# EAGLE design Panel2 (EAGLE 9.2.0)
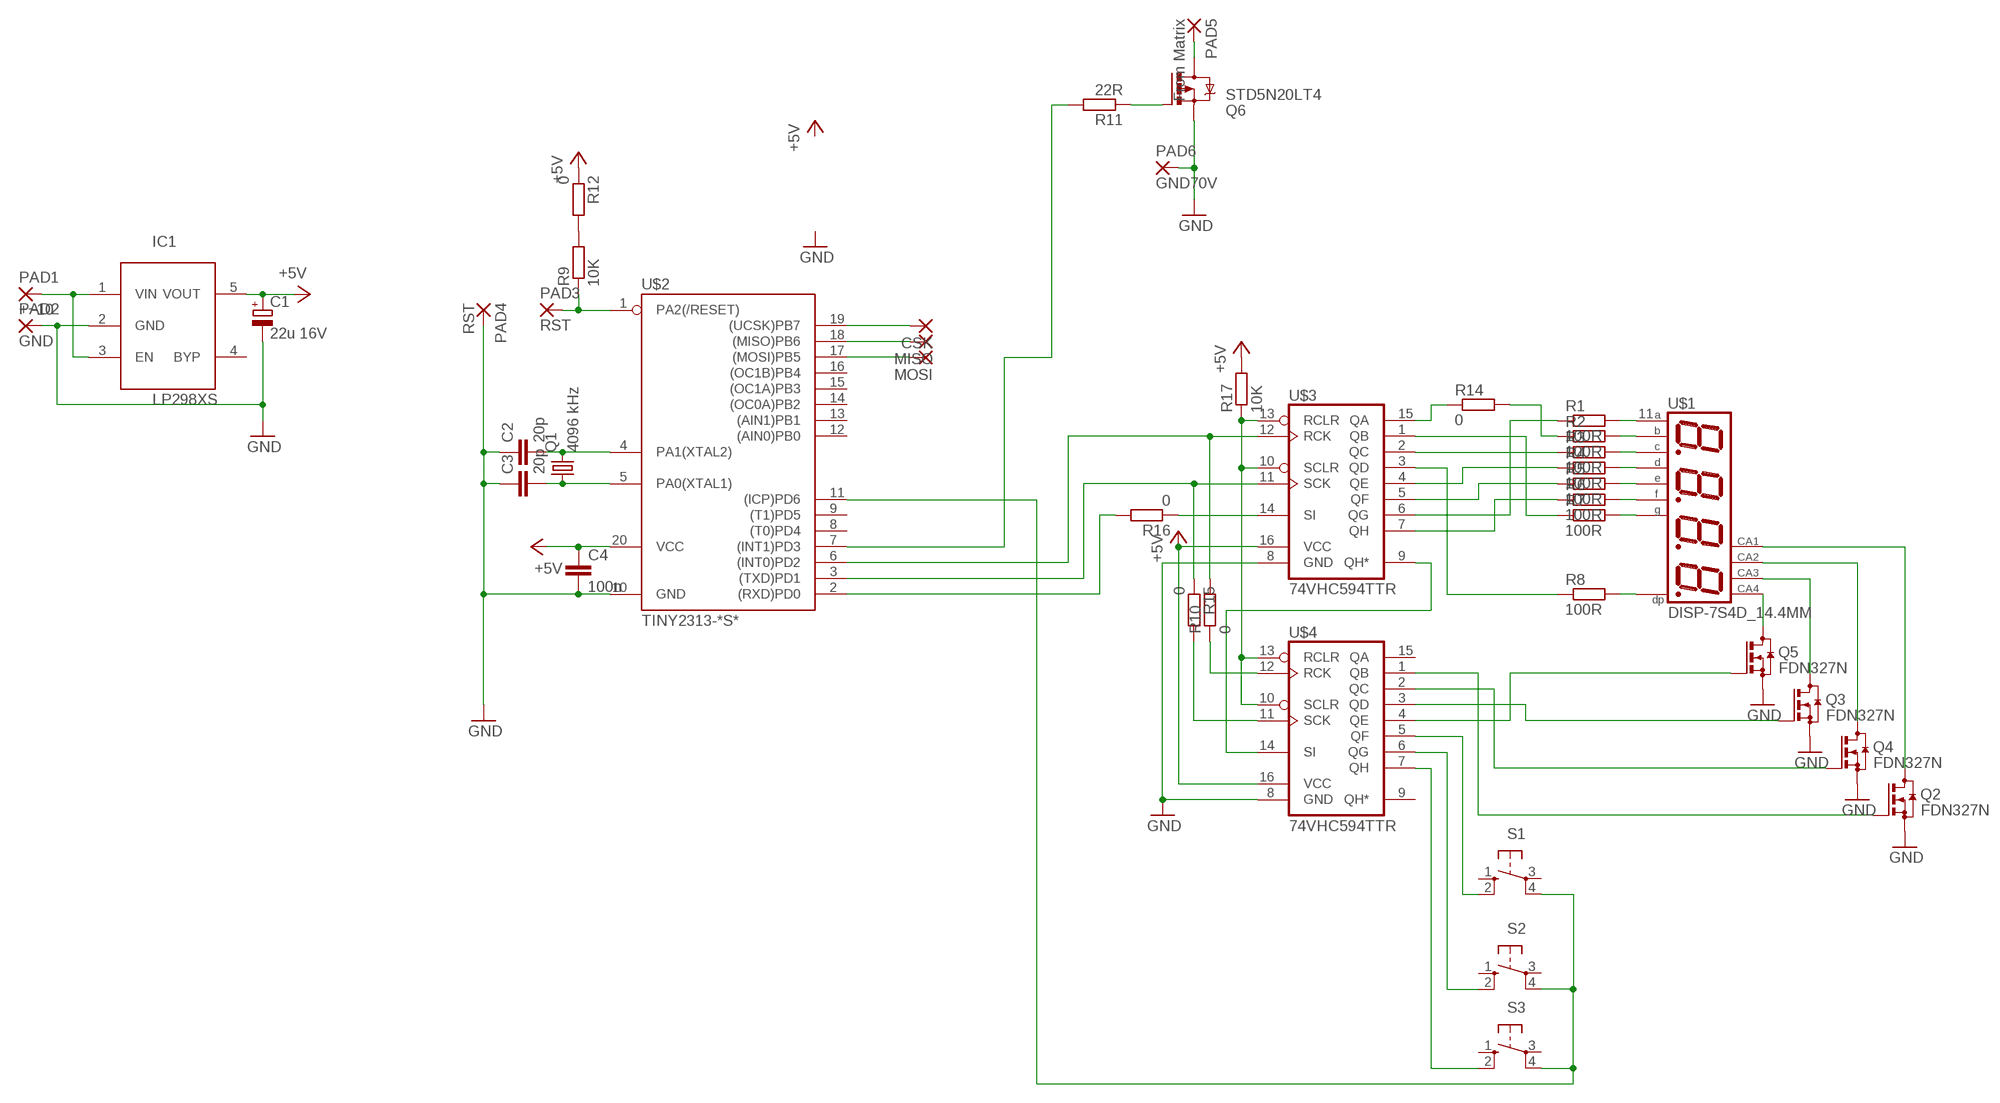
[diagram p0: schematic, sheet 1]

## Parts
C1  22u 16V  CPOL-EUSMCB  [SMC_B]
C2  20p  C-EUC1206  [C1206]
C3  20p  C-EUC1206  [C1206]
C4  100n  C-EUC1206  [C1206]
CSK  SMD2  [SMD1,27-2,54]
IC1  LP298XS  [SOT23-5L]
MISO  SMD2  [SMD1,27-2,54]
MOSI  SMD2  [SMD1,27-2,54]
PAD1  +~10  WIREPADSMD5-2,5  [5-2,5]
PAD2  GND  WIREPADSMD5-2,5  [5-2,5]
PAD3  RST  WIREPADSMD1,27-254  [SMD1,27-2,54]
PAD4  RST  WIREPADSMD1,27-254  [SMD1,27-2,54]
PAD5  From Matrix  WIREPADSMD2,54-5,08  [SMD2,54-5,08]
PAD6  GND70V  WIREPADSMD2,54-5,08  [SMD2,54-5,08]
Q1  4096 kHz  CRYSTALHC49U-V  [HC49U-V]
Q2  FDN327N  BSS123  [SOT23]
Q3  FDN327N  BSS123  [SOT23]
Q4  FDN327N  BSS123  [SOT23]
Q5  FDN327N  BSS123  [SOT23]
Q6  STD5N20LT4  IRFR5305  [D-PAK_TO252AA]
R1  100R  R-EU_R1206  [R1206]
R2  100R  R-EU_R1206  [R1206]
R3  100R  R-EU_R1206  [R1206]
R4  100R  R-EU_R1206  [R1206]
R5  100R  R-EU_R1206  [R1206]
R6  100R  R-EU_R1206  [R1206]
R7  100R  R-EU_R1206  [R1206]
R8  100R  R-EU_R1206  [R1206]
R9  10K  R-EU_R1206  [R1206]
R10  0  R-EU_R1206  [R1206]
R11  22R  R-EU_R1206  [R1206]
R12  0  R-EU_R1206  [R1206]
R14  0  R-EU_R1206  [R1206]
R15  0  R-EU_R1206  [R1206]
R16  0  R-EU_R1206  [R1206]
R17  10K  R-EU_R1206  [R1206]
S1  40-XX  [B3F-40XX]
S2  40-XX  [B3F-40XX]
S3  40-XX  [B3F-40XX]
U$1  DISP-7S4D_14.4MM  [DISP-7S4D]
U$2  TINY2313-*S*  [SO20L$]
U$3  74VHC594TTR  [TSSOP16]
U$4  74VHC594TTR  [TSSOP16]

## Nets
+5V: C1.+ C4.1 IC1.5(VOUT) R12.1 R17.2 U$2.20(VCC) U$3.16(VCC) U$4.16(VCC)
GND: C1.- C2.1 C3.1 C4.2 IC1.2(GND) PAD2.1(P) PAD4.1(P) PAD6.1(P) Q2.2(S) Q3.2(S) Q4.2(S) Q5.2(S) Q6.3(S) U$2.10(GND) U$3.8(GND) U$4.8(GND)
N$1: R1.2 U$1.11(A)
N$2: R2.2 U$1.7(B)
N$3: Q5.3(D) U$1.6(С4)
N$4: R3.2 U$1.4(C)
N$5: Q4.3(D) U$1.9(С2)
N$6: R4.2 U$1.2(D)
N$7: R5.2 U$1.1(E)
N$8: R6.2 U$1.10(F)
N$9: R7.2 U$1.5(G)
N$10: R8.2 U$1.3(DP)
N$11: IC1.1(VIN) IC1.3(EN) PAD1.1(P)
N$12: C2.2 Q1.2 U$2.4(PA1(XTAL2))
N$13: C3.2 Q1.1 U$2.5(PA0(XTAL1))
N$14: PAD3.1(P) R9.1 U$2.1(PA2(/RESET))
N$15: Q2.3(D) U$1.12(С1)
N$16: U$3.9(QH*) U$4.14(SI)
N$17: R15.1 U$2.3((TXD)PD1) U$3.11(SCK)
N$18: R10.2 U$2.6((INT0)PD2) U$3.12(RCK)
N$19: R17.1 U$3.10(SCLR) U$3.13(RCLR) U$4.10(SCLR) U$4.13(RCLR)
N$20: R14.1 U$3.15(QA)
N$21: Q2.1(G) U$4.1(QB)
N$22: R10.1 U$4.12(RCK)
N$23: R15.2 U$4.11(SCK)
N$24: R16.1 U$3.14(SI)
N$25: R7.1 U$3.1(QB)
N$26: R3.1 U$3.2(QC)
N$27: R8.1 U$3.3(QD)
N$28: R4.1 U$3.4(QE)
N$29: R5.1 U$3.5(QF)
N$30: R1.1 U$3.6(QG)
N$31: CSK.1(P) U$2.19((UCSK)PB7)
N$32: MISO.1(P) U$2.18((MISO)PB6)
N$33: MOSI.1(P) U$2.17((MOSI)PB5)
N$34: R6.1 U$3.7(QH)
N$35: R2.1 R14.2
N$36: Q4.1(G) U$4.2(QC)
N$37: Q3.1(G) U$4.3(QD)
N$38: Q3.3(D) U$1.8(С3)
N$39: Q5.1(G) U$4.4(QE)
N$40: S1.2(S1) U$4.5(QF)
N$41: Q6.1(G) R11.1
N$42: S2.2(S1) U$4.6(QG)
N$43: S3.2(S1) U$4.7(QH)
N$44: S1.4(P1) S2.4(P1) S3.4(P1) U$2.11((ICP)PD6)
N$45: R11.2 U$2.7((INT1)PD3)
N$46: R16.2 U$2.2((RXD)PD0)
N$47: PAD5.1(P) Q6.4(D)
N$48: R9.2 R12.2
Unconnected: IC1.4(BYP) S1.1(S) S1.3(P) S2.1(S) S2.3(P) S3.1(S) S3.3(P) U$2.8((T0)PD4) U$2.9((T1)PD5) U$2.12((AIN0)PB0) U$2.13((AIN1)PB1) U$2.14((OC0A)PB2) U$2.15((OC1A)PB3) U$2.16((OC1B)PB4) U$4.9(QH*) U$4.15(QA)

## Library data of the parts
C1 = rcl:CPOL-EU: POLARIZED CAPACITOR, European symbol; SPICEPREFIX: C
C2-C4 = rcl:C-EU: CAPACITOR, European symbol; SPICEPREFIX: C
CSK MISO MOSI = wirepad:SMD2: SMD PAD
IC1 = Namenlos at:LP298X
PAD1-PAD6 = wirepad:WIREPAD: Wire PAD connect wire on PCB
Q1 = crystal:CRYSTAL: CRYSTAL; OC_FARNELL: 1666969; OC_NEWARK: unknown
Q2-Q5 = transistor-small-signal:BSS123: N-CHANNEL MOS FET
Q6 = transistor-power:IRF?5305: HEXFET Power MOSFET Source: http://www.irf.com/product-info/datasheets/data/irfr5305pbf.pdf
R1-R12 R14-R17 = rcl:R-EU_: RESISTOR, European symbol; SPICEPREFIX: R
S1-S3 = switch-omron:40-XX: OMRON SWITCH; MF: OMRON COMPONENTS USA; MPN: B3F-4000; OC_FARNELL: 176434; OC_NEWARK: 36K3105
U$1 = display-4d:DISP-7S4D_14.4MM
U$2 = avr-7:TINY2313*: Atmel Tiny2313 2K Flash, 128 bytes EEPROM, 128 bytes RAM
U$3 U$4 = Namenlos:74VHC594TTR

## Board
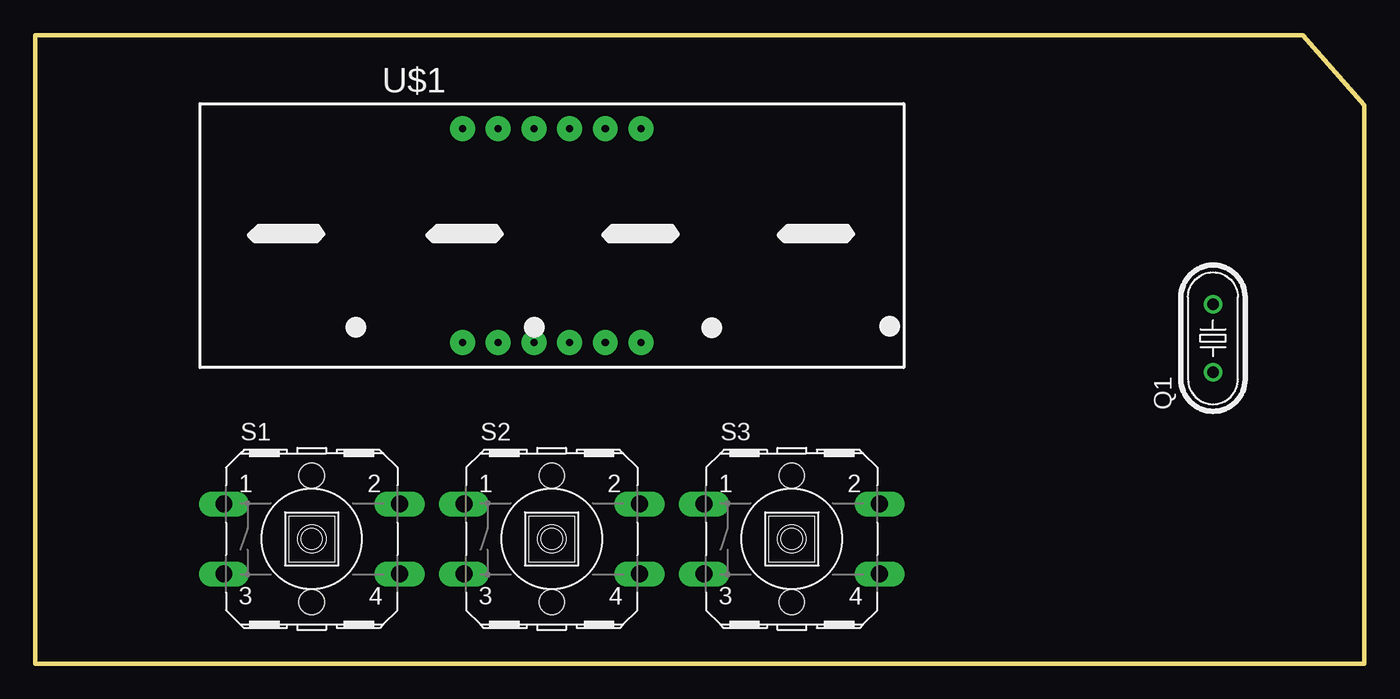
[diagram p1: board, top side]
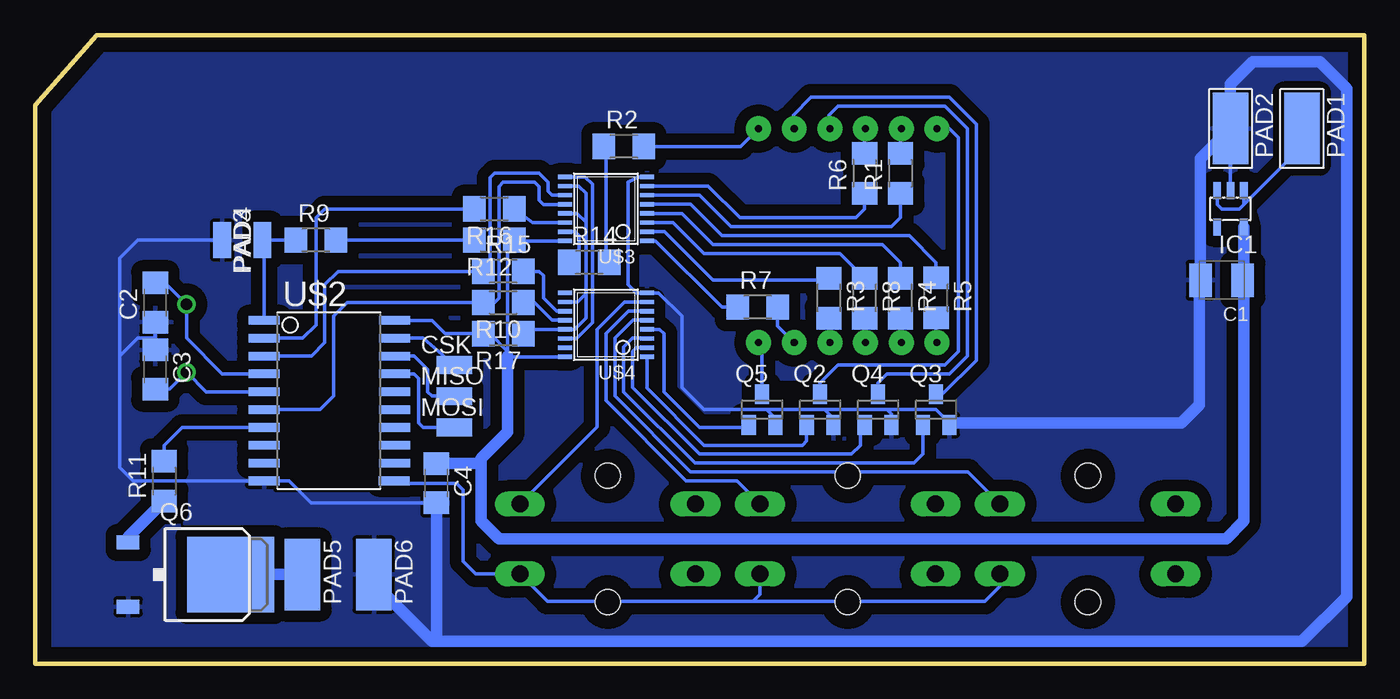
[diagram p2: board, bottom side, seen from below]

Size 94.59 x 44.76 mm. Coordinates in mm from the lower left corner, seen from the top.
Outline: 0,0 94.59,0 94.59,39.76 90.23,44.76 0,44.76 0,0
Copper layers (1*16): Top 0.035mm / dielectric 1.5mm / Bottom 0.035mm
Design rules "default": minimum track width 10mil, minimum drill 24mil, track to track 8mil, track to pad 8mil, pad to pad 8mil, via to via 8mil, smd to smd 8mil, copper to edge 40mil, drill to drill 8mil, minimum pad ring 10mil, minimum via ring 8mil, stop-mask expansion 4mil, vias tented up to drill 0mil, thermal gap 10mil

### Footprints (pad centres in the part's own frame; a part is rotated, then mirrored left to right if it is on the bottom)
SMC_B = smd 1.6 x 2.4: + -1.5,0; - 1.5,0
C1206 = smd 1.6 x 1.8: 1 -1.4,0; 2 1.4,0
SMD1,27-2,54 = smd 1.27 x 2.54: 1 0,0
SOT23-5L = smd 0.55 x 1.2: 1 -0.95,-1.3; 2 0,-1.3; 3 0.95,-1.3; 4 0.95,1.3; 5 -0.95,1.3
5-2,5 = smd 2.54 x 5.08: 1 0,0
SMD2,54-5,08 = smd 2.54 x 5.08: 1 0,0
HC49U-V = drill 0.813: 1 -2.413,0; 2 2.413,0
SOT23 = smd 1 x 1.4: 1 -0.95,-1.1; 2 0.95,-1.1; 3 0,1.1
D-PAK_TO252AA = smd 1 x 1.6: 1 -2.28,-4.8; 3 2.28,-4.8 | smd 5.4 x 6.2: 4 0,2.5
R1206 = smd 1.6 x 1.803: 1 -1.422,0; 2 1.422,0
B3F-40XX = drill 1.194 long: 1 -6.248,2.489; 2 6.248,2.489; 3 -6.248,-2.489; 4 6.248,-2.489 | hole 1.803: 0,-4.496; 0,4.496
DISP-7S4D = drill 0.5 pad 1.778: 1 -6.35,-7.62; 2 -3.81,-7.62; 3 -1.27,-7.62; 4 1.27,-7.62; 5 3.81,-7.62; 6 6.35,-7.62; 7 6.35,7.62; 8 3.81,7.62; 9 1.27,7.62; 10 -1.27,7.62; 11 -3.81,7.62; 12 -6.35,7.62
SO20L$ = smd 0.61 x 2.21: 1 -5.715,-4.636; 2 -4.445,-4.636; 3 -3.175,-4.636; 4 -1.905,-4.636; 5 -0.635,-4.636; 6 0.635,-4.636; 7 1.905,-4.636; 8 3.175,-4.636; 9 4.445,-4.636; 10 5.715,-4.636; 11 5.715,4.61; 12 4.445,4.636; 13 3.175,4.636; 14 1.905,4.636; 15 0.635,4.636; 16 -0.635,4.636; 17 -1.905,4.636; 18 -3.175,4.636; 19 -4.445,4.636; 20 -5.715,4.636
TSSOP16 = smd 0.305 x 0.991: 1 -2.275,-2.918; 2 -1.625,-2.918; 3 -0.975,-2.918; 4 -0.325,-2.918; 5 0.325,-2.918; 6 0.975,-2.918; 7 1.625,-2.918; 8 2.275,-2.918; 9 2.275,2.918; 10 1.625,2.918; 11 0.975,2.918; 12 0.325,2.918; 13 -0.325,2.918; 14 -0.975,2.918; 15 -1.625,2.918; 16 -2.275,2.918

### Placement (x,y rotation side)
C1  10.16,27.3 180 bottom
C2  86.04,25.72 90 bottom
C3  86.04,20.95 270 bottom
C4  66.04,12.86 270 bottom
CSK  64.77,21.27 270 bottom
IC1  9.53,32.38 180 bottom
MISO  64.77,19.05 270 bottom
MOSI  64.77,16.83 270 bottom
PAD1  4.45,38.1 180 bottom
PAD2  9.53,38.1 180 bottom
PAD3  78.42,30.16 0 bottom
PAD4  81.28,30.16 180 bottom
PAD5  75.57,6.35 180 bottom
PAD6  70.48,6.35 180 bottom
Q1  83.82,23.18 90 top
Q2  38.73,18.1 0 bottom
Q3  30.48,18.1 0 bottom
Q4  34.61,18.1 0 bottom
Q5  42.86,18.1 0 bottom
Q6  83.19,6.35 270 bottom
R1  33.02,34.92 90 bottom
R2  52.7,36.83 0 bottom
R3  38.1,26.04 270 bottom
R4  33.02,26.04 270 bottom
R5  30.48,26.05 270 bottom
R6  35.56,34.92 90 bottom
R7  43.18,25.4 0 bottom
R8  35.56,26.04 270 bottom
R9  74.61,30.16 0 bottom
R10  61.28,25.72 180 bottom
R11  85.41,13.02 90 bottom
R12  61.91,30.16 180 bottom
R14  55.17,28.57 0 bottom
R15  61.28,27.94 0 bottom
R16  61.91,32.38 180 bottom
R17  61.28,23.5 180 bottom
S1  19.69,8.89 0 top
S2  36.77,8.89 0 top
S3  53.84,8.89 0 top
U$1  36.77,30.48 0 top
U$2  73.66,18.73 270 bottom
U$3  53.98,32.38 90 bottom
U$4  53.98,24.13 90 bottom

### Tracks (layer width: path | path; a pad name or v marks a point on that pad's centre or on a via)
+5V
  Bottom 0.254: 60.96,22.23 60.96,21.91 60.91,21.86 60.38,21.86 U$4.16 | 60.96,22.23 60.96,29.53 60.48,30 | U$3.16 60.38,30.11 60.48,30 | 60.96,22.23 62.23,23.5 R17.2 65.41,23.5 66.36,24.45 U$2.20 | 8.58,27.39 C1.+ 8.57,27.22 | 63.21,14.26 62.87,14.61 | R12.1 60.49,30.01 60.48,30
  Bottom 0.813: IC1.5 8.58,27.39 | 60.96,21.91 60.96,16.51 62.87,14.61 62.87,10.16 61.59,8.89 9.84,8.89 8.57,10.16 8.57,27.22 | C4.1 63.21,14.26
GND
  Bottom 0.254: U$3.8 51.7,34.66 52.39,34.29 52.39,26.99 51.8,26.41 U$4.8 50.22,26.41 48.58,24.77 48.58,19.68 46.99,18.1 42.55,18.1 | Q3.2 29.53,17.15 30.48,18.1 33.97,18.1 | 33.97,18.1 38.42,18.1 | 38.42,18.1 42.55,18.1 | Q4.2 33.66,17.78 33.97,18.1 | Q2.2 37.79,17.46 38.42,18.1 | Q5.2 41.91,17.46 42.55,18.1 | C3.1 86.04,23.18 | 86.04,23.18 C2.1 | 78.15,12.87 U$2.10 | PAD2.1 IC1.2 | 11.75,27.22 C1.- | PAD6.1 70.48,5.71 | C4.2 74.96,11.46 76.52,13.02 U$2.10 | U$2.10 87.63,13.02 88.58,13.97 88.58,21.59 | 88.58,21.59 88.58,21.91 87.31,23.18 86.04,23.18 | PAD4.1 87.31,30.16 88.58,28.89 88.58,21.59
  Bottom 0.813: C1.- 11.66,35.97 PAD2.1 9.53,41.27 7.94,42.86 3.18,42.86 1.27,40.96 1.27,4.76 4.45,1.59 64.45,1.59 | 29.53,17.15 13.02,17.15 11.75,18.41 11.75,27.22 | 70.48,5.71 66.36,1.59 64.45,1.59 | C4.2 66.04,1.59 64.45,1.59
  pour Bottom (isolate 0.813): 0,44.77 89.54,44.77 94.62,39.69 94.62,0 0,0
N$1
  Bottom 0.254: R1.2 33.02,37.53 U$1.11
N$2
  Bottom 0.254: R2.2 44.38,36.83 U$1.7
N$3
  Bottom 0.254: Q5.3 42.86,22.61 U$1.6
N$4
  Bottom 0.254: R3.2 38.1,22.93 U$1.4
N$5
  Bottom 0.254: Q4.3 34.61,20 33.97,20.64 29.53,20.64 28.26,21.91 28.26,38.1 29.84,39.69 37.47,39.69 38.1,39.05 38.1,38.16 U$1.9
N$6
  Bottom 0.254: R4.2 33.02,22.93 U$1.2
N$7
  Bottom 0.254: R5.2 30.48,22.93 U$1.1
N$8
  Bottom 0.254: R6.2 35.56,37.53 U$1.10
N$9
  Bottom 0.254: R7.2 41.76,24.04 U$1.5
N$10
  Bottom 0.254: R8.2 35.56,22.93 U$1.3
N$11
  Bottom 0.254: IC1.1 8.58,32.7 8.73,32.54 | 8.73,32.54 8.89,32.38 10.16,32.38 10.47,32.7 IC1.3 | PAD1.1 3.81,37.47 8.73,32.54
N$12
  Bottom 0.254: U$2.4 81.28,20.64 83.82,23.18 Q1.2 85.35,27.12 C2.2
N$13
  Bottom 0.254: U$2.5 82.42,19.37 Q1.1 85.03,19.55 C3.2
N$14
  Bottom 0.254: R9.1 PAD3.1 78.3,30.04 U$2.1
N$15
  Bottom 0.254: Q2.3 38.73,20 37.47,21.27 29.84,21.27 28.89,22.23 28.89,37.47 29.53,38.1 U$1.12
N$16
  Bottom 0.254: U$3.9 55.62,34.66 55.46,34.66 54.93,34.13 54.93,24.29 56.06,23.16 U$4.14
N$17
  Bottom 0.254: U$2.3 74.93,21.91 73.98,22.86 73.98,26.99 73.03,27.94 R15.1 62.22,28.74 62.23,32.7 62.23,34.61 61.91,34.92 58.74,34.92 58.1,34.29 58.1,33.66 57.81,33.36 U$3.11
N$18
  Bottom 0.254: U$2.6 74.3,18.1 73.34,19.05 73.34,24.77 72.39,25.72 R10.2 61.91,25.72 61.59,26.04 61.59,32.07 61.59,32.38 61.59,33.97 61.28,34.29 59.05,34.29 58.74,33.97 58.74,33.02 58.42,32.7 U$3.12
N$19
  Bottom 0.254: 55.4,26.35 55.4,24.61 56.2,23.8 U$4.13 59.55,23.8 R17.1 | 55.4,26.35 55.4,31.43 | U$3.13 56.03,32.06 55.4,31.43 | U$3.10 55.92,34.01 55.88,33.97 55.4,33.5 55.4,31.43 | U$4.10 56,25.75 55.4,26.35
N$20
  Bottom 0.254: R14.1 56.83,28.26 55.88,29.21 55.88,30.48 56.16,30.76 U$3.15
N$21
  Bottom 0.254: U$4.1 51.06,19.62 46.99,15.56 40.01,15.56 39.69,15.88 Q2.1
N$22
  Bottom 0.254: U$4.12 57.79,24.45 59.05,25.72 R10.1
N$23
  Bottom 0.254: U$4.11 57.49,25.11 58.42,26.04 58.42,27.62 58.74,27.94 R15.2
N$24
  Bottom 0.254: U$3.14 59.2,31.41 R16.1
N$25
  Bottom 0.254: U$3.1 50.43,30.11 45.72,25.4 R7.1
N$26
  Bottom 0.254: R3.1 38.25,27.3 45.72,27.3 46.35,27.3 49.81,30.76 U$3.2
N$27
  Bottom 0.254: R8.1 37.31,29.21 45.09,29.21 46.99,29.21 49.19,31.41 U$3.3
N$28
  Bottom 0.254: R4.1 33.02,28.57 34.29,29.84 45.72,29.84 46.35,29.84 48.57,32.06 U$3.4
N$29
  Bottom 0.254: R5.1 30.48,28.57 32.38,30.48 45.72,30.48 47.95,32.71 U$3.5
N$30
  Bottom 0.254: 44.45,31.11 45.09,31.11 | 45.09,31.11 33.66,31.11 33.02,31.75 R1.1 | U$3.6 47.33,33.36 45.09,31.11
N$31
  Bottom 0.254: U$2.19 66.99,23.18 CSK.1
N$32
  Bottom 0.254: U$2.18 67.63,21.91 66.67,20.95 66.67,19.37 66.36,19.05 MISO.1
N$33
  Bottom 0.254: U$2.17 67.63,20.64 67.31,20.32 67.31,17.14 66.99,16.83 MOSI.1
N$34
  Bottom 0.254: R6.1 35.56,32.38 36.2,31.75 44.45,31.75 46.71,34.01 U$3.7
N$35
  Bottom 0.254: R2.1 53.98,36.68 53.98,31.75 53.98,28.42 R14.2
N$36
  Bottom 0.254: U$4.2 51.79,22.5 52.07,22.23 52.07,19.68 47.31,14.92 36.51,14.92 35.88,15.56 35.88,16.68 Q4.1
N$37
  Bottom 0.254: U$4.3 51.09,23.16 51.12,23.18 52.07,23.18 52.7,22.54 52.7,19.37 47.62,14.29 32.07,14.29 31.43,14.92 31.43,16.36 Q3.1
N$38
  Bottom 0.254: Q3.3 30.02,19.2 27.62,21.59 27.62,38.42 29.53,40.32 39.37,40.32 40.64,39.05 40.64,38.16 U$1.8
N$39
  Bottom 0.254: U$4.4 50.16,23.8 49.85,23.5 49.85,19.37 47.31,16.83 43.96,16.83 Q5.1
N$40
  Bottom 0.254: U$4.5 52.06,24.45 53.34,23.18 53.34,19.05 47.94,13.65 28.21,13.65 S1.2
N$41
  Bottom 0.813: Q6.1 87.98,9.02 R11.1
N$42
  Bottom 0.254: U$4.6 52.37,25.11 53.98,23.5 53.98,18.73 48.26,13.02 44.65,13.02 S2.2
N$43
  Bottom 0.254: U$4.7 52.67,25.75 54.61,23.81 54.61,16.86 S3.2 60.04,11.43
N$44
  Bottom 0.254: S1.4 25.93,5.5 26.99,4.45 43.5,4.45 | 43.5,4.45 58.14,4.45 S3.4 63.23,6.4 64.14,7.3 64.14,12.38 64.61,12.85 69.22,12.85 U$2.11 | S2.4 43.01,4.93 43.5,4.45
N$45
  Bottom 0.254: U$2.7 84.14,16.83 85.41,15.56 R11.2
N$46
  Bottom 0.254: U$2.2 75.57,23.18 74.61,24.13 74.61,31.75 73.98,32.38 R16.2
N$47
  Bottom 0.813: PAD5.1 Q6.4
N$48
  Bottom 0.254: R12.2 R9.2
N$49
  cutout Bottom: 70.17,25.08 77.47,25.08 77.47,12.38 70.17,12.38
N$50
  cutout Bottom: 56.2,21.59 56.2,34.92 51.75,34.92 51.75,21.59
N$51
  cutout Bottom: 28.89,20 44.13,20 44.13,16.51 29.21,16.51 29.21,20